# Altium schematic sheet SensorRig.SchDoc
size Letter
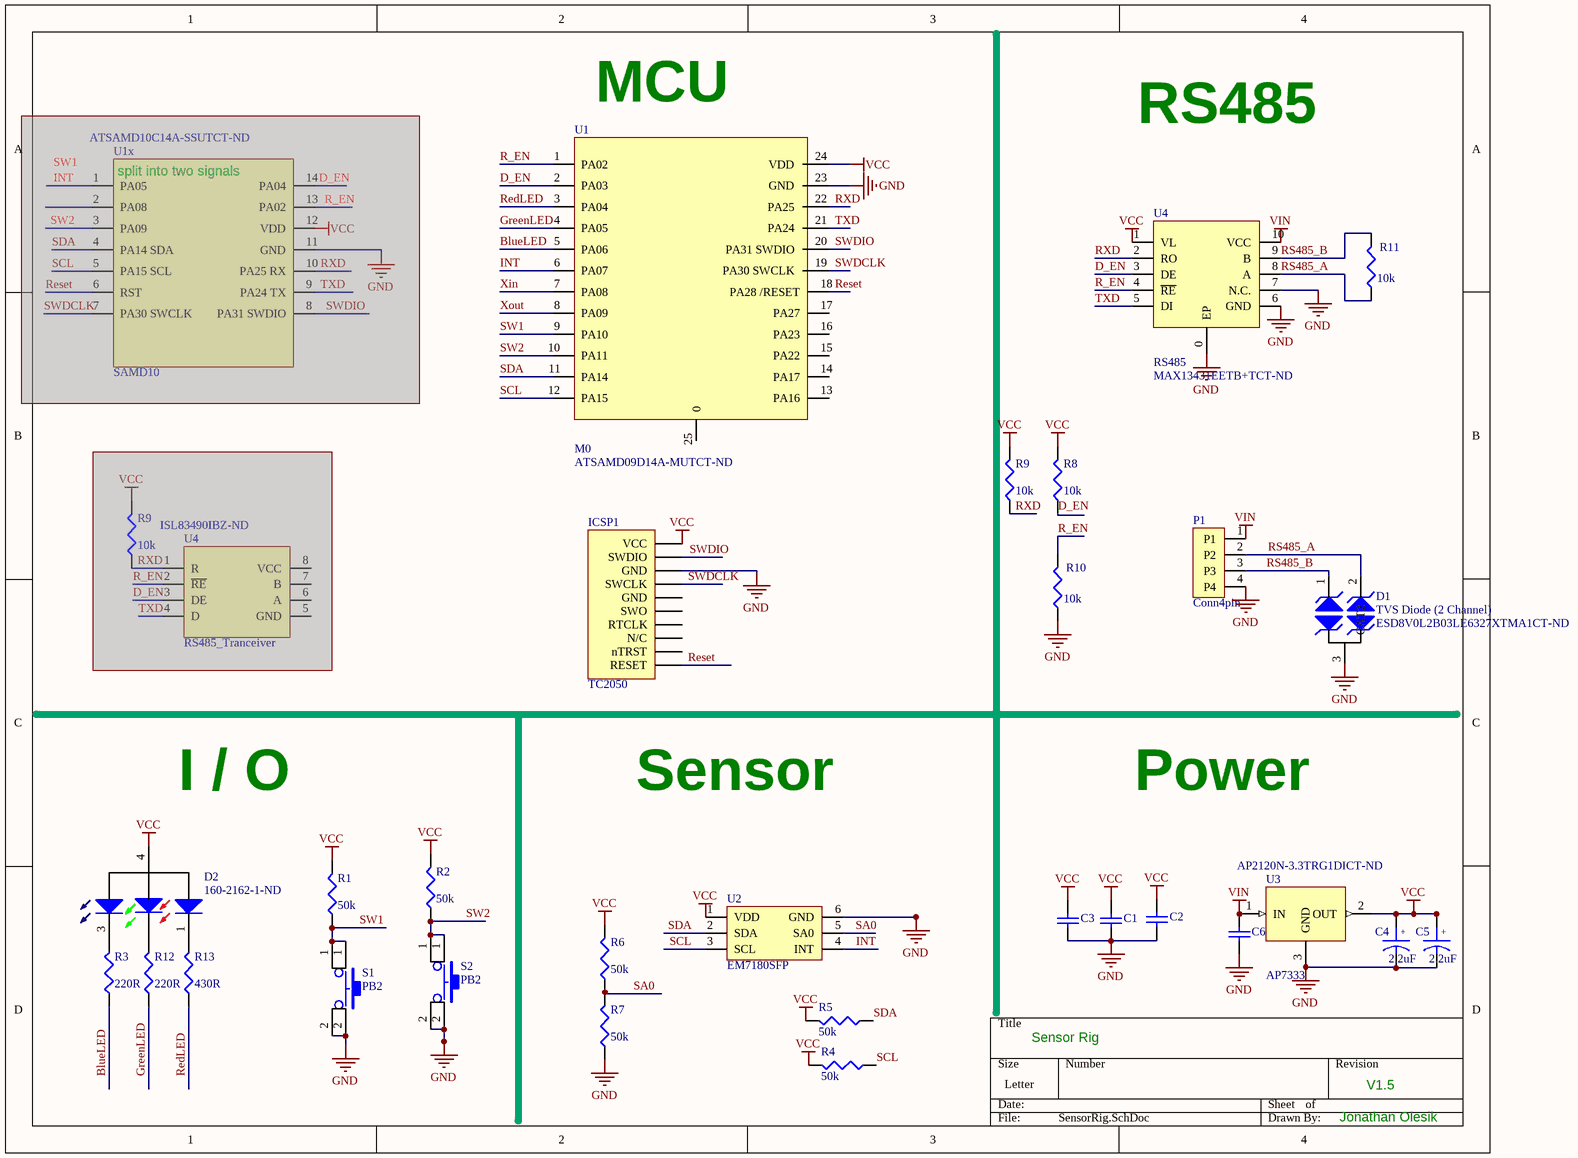
[diagram p0: SensorRig.SchDoc]

## Parts
(Parts that share a designator on the sheet are numbered #1, #2 ... from top to bottom, then left to right.)
C1  100nF  [0603]  (value not drawn)
C2  4.7uF  [0603]  (value not drawn)
C3  Cap  [0603]  (value not drawn)
C4  value 2.2uF  [SMD0805]
C5  value 2.2uF  [SMD0805]
C6  10uF  [0603]  (value not drawn)
D1  TVS Diode (2 Channel)  Supplier Part Number: ESD8V0L2B03LE6327XTMA1CT-ND  [SON35P100X50-3N]
D2  Supplier Part Number: 160-2162-1-ND  [LED RGB]  (hidden comment: LED2_RGB)
ICSP1  TC2050  [TagConnect]
P1  Conn4pin  [Bourns 70AB/Male (4 conn)]
R1  value 50k  [0603]
R2  value 50k  [0603]
R3  value 220R  [0603]
R4  value 50k  [0603]
R5  value 50k  [0603]
R6  value 50k  [0603]
R7  value 50k  [0603]
R8  value 10k  [0603]
R9#1  value 10k  [0603]
R9#2  value 10k  [0603]  (masked out: inside a compile mask, not in the netlist)
R10  value 10k  [0603]
R11  value 10k  [0603]
R12  value 220R  [0603]
R13  value 430R  [0603]
S1  PB2  [PTS840]
S2  PB2  [PTS840]
U1  M0  Supplier Part Number: ATSAMD09D14A-MUTCT-ND  [QFN50P400X400X80_HS-25N]
U1x  SAMD10  Supplier Part Number: ATSAMD10C14A-SSUTCT-ND  [SOIC14]  (masked out: inside a compile mask, not in the netlist)
U2  EM7180SFP  [EM7180SFP]
U3  AP7333  Supplier Part Number: AP2120N-3.3TRG1DICT-ND  [SOT23-3]
U4#1  RS485  Supplier Part Number: MAX13431EETB+TCT-ND  [DFN10_3X3MM]
U4#2  RS485_Tranceiver  Supplier Part Number: ISL83490IBZ-ND  [SOIC8]  (masked out: inside a compile mask, not in the netlist)

## Nets
GND: C1.1 C2.1 C3.1 C4.2 C5.2 C6.1 D1.3(Double_Cat) ICSP1.3(GND) P1.4(P4) R7.1 R10.1 S1.2 S2.2 U1.23(GND) U2.6(GND) U3.3(GND) U4#1.0(EP) U4#1.6(GND) U4#1.7(N.C.)
VCC: C1.2 C2.2 C3.2 C4.1 C5.1 D2.4 ICSP1.1(VCC) R1.2 R2.2 R4.2 R5.2 R6.2 R8.2 R9#1.2 U1.24(VDD) U2.1(VDD) U3.2(OUT) U4#1.1(VL)
VIN: C6.2 P1.1(P1) U3.1(IN) U4#1.10(VCC)
BlueLED: R3.1 U1.5(PA06)
D_EN: R8.1 U1.2(PA03) U4#1.3(DE)
GreenLED: R12.1 U1.4(PA05)
INT: U1.6(PA07) U2.4(INT)
R_EN: R10.2 U1.1(PA02) U4#1.4(~{RE})
RedLED: R13.1 U1.3(PA04)
Reset: ICSP1.10(RESET) U1.18(PA28_/RESET)
RS485_A: D1.2(CAT2) P1.2(P2) R11.1 U4#1.8(A)
RS485_B: D1.1(CAT1) P1.3(P3) R11.2 U4#1.9(B)
RXD: R9#1.1 U1.22(PA25) U4#1.2(RO)
SA0: R6.1 R7.2 U2.5(SA0)
SCL: R4.1 U1.12(PA15) U2.3(SCL)
SDA: R5.1 U1.11(PA14) U2.2(SDA)
SW1: R1.1 S1.1 U1.9(PA10)
SW2: R2.1 S2.1 U1.10(PA11)
SWDCLK: ICSP1.4(SWCLK) U1.19(PA30_SWCLK)
SWDIO: ICSP1.2(SWDIO) U1.20(PA31_SWDIO)
TXD: U1.21(PA24) U4#1.5(DI)
Xin: U1.7(PA08)
Xout: U1.8(PA09)
NetD2_1: D2.1 R13.2
NetD2_2: D2.2 R12.2
NetD2_3: D2.3 R3.2

Not connected (* = marked no-connect by the designer): ICSP1 5(GND) 6(SWO) 7(RTCLK) 8(N/C) 9(nTRST); U1 13(PA16) 14(PA17) 15(PA22) 16(PA23) 17(PA27) 25(0)

## Notes on the sheet
- (near U1) MCU
- RS485
- (near U1x) split into two signals
- I / O
- Sensor
- Power
- Sensor Rig
- V1.5
- Jonathan Olesik
- (in symbol A01-0492) +

## Library data of the parts
C1-C3 C6 = Cap: Capacitor; Published: 8-Jun-2000; LatestRevisionDate: 17-Jul-2002; LatestRevisionNote: Re-released for DXP Platform.; PackageReference: RAD-0.3; Publisher: Altium Limited
C4 C5 = A01-0492: Manufacturer Size Code: P; Manufacturer: AVX Corporation; Manufacturer Part Number: F921A225MPA; Tolerance: ±20%; Type: Molded; ESR (Equivalent Series Resistance): 12 Ohm; Capacitance: 2.2µF; Voltage - Rated: 10V; Category: Capacitors; Size / Dimension: 0.079" L x 0.049" W (2.00mm x 1.25mm); RoHS: RoHS Compliant; Operating Temperature: -55°C ~ 125°C; Mounting Type: Surface Mount; Package / Case: 0805 (2012 Metric); Height - Seated (Max): 0.039" (1.00mm); Lifetime @ Temp.: -; Supplier: Digi-Key; Packaging: Cut Tape (CT); Features: General Purpose; Lead Spacing: -; Supplier Part Number: 478-8123-1-ND; ComponentLink1URL: http://www.avx.com/docs/Catalogs/f92.pdf; ComponentLink1Description: http://www.avx.com/docs/Catalogs/f92.pdf; Pricing: 1=0.45, 10=0.397, 100=0.1983, 250=0.15856, 500=0.14442, 1000=0.13025 (CAD)
D1 = TVS Diode (2 Channel): Manufacturer Part Number: ESD8V0L2B-03L E6327; Manufacturer: Infineon Technologies; Type: Zener; Bidirectional Channels: 2; Description: TVS DIODE 22VWM 26VC TSLP2; Voltage - Reverse Standoff (Typ): 22V (Max); Voltage - Breakdown (Min): 23V (Typ); Capacitance @ Frequency: 4pF @ 1MHz; Current - Peak Pulse (10/1000µs): 1A (8/20µs); Voltage - Clamping (Max) @ Ipp: 26V (Typ); Power Line Protection: No; Supplier: Digi-Key; Category: Circuit Protection; Unidirectional Channels: -; RoHS: RoHS Compliant; Applications: General Purpose; Package / Case: SC-101, SOT-883; Power - Peak Pulse: -; Operating Temperature: -55°C ~ 125°C (TJ); Supplier Device Package: PG-TSLP-3; Packaging: Cut Tape (CT); Mounting Type: Surface Mount; ComponentLink1URL: http://www.infineon.com/dgdl/esd8v0lseries.pdf?folderId=db3a30431441fb5d011488a9e66f0ded&fileId=db3a30431441fb5d011488ab01860dee; ComponentLink1Description: http://www.infineon.com/dgdl/esd8v0lseries.pdf?folderId=db3a30431441fb5d011488a9e66f0ded&fileId=db3a30431441fb5d011488ab01860dee; Pricing: 1=0.59, 10=0.438, 100=0.2481, 500=0.16456, 1000=0.1262 (CAD)
D2 = LED2_RGB: RGB Led; Manufacturer Part Number: LTST-C19HE1WT; Manufacturer: Lite-On Inc; Lens Transparency: Diffused; Millicandela Rating: 112.5mcd Red, 281mcd Green, 104mcd Blue; Wavelength - Dominant: 624nm Red, 525nm Green, 470nm Blue; Wavelength - Peak: 632nm Red, 520nm Green, 468nm Blue; Lens Color: White; Current - Test: 20mA Red, 20mA Green, 20mA Blue; Voltage - Forward (Vf) (Typ): 2.1V Red, 3.35V Green, 3.35V Blue; Color: Red, Green, Blue (RGB); Lens Style/Size: Rectangle with Flat Top, 1.15mm x 1.60mm; Viewing Angle: 130°; Package / Case: 0606 (1616 Metric); Supplier: Digi-Key; Height (Max): 0.35mm; Size / Dimension: 1.60mm L x 1.60mm W; RoHS: RoHS Compliant; Mounting Type: Surface Mount; Category: Optoelectronics; Packaging: Cut Tape (CT); Supplier Device Package: *; Pricing: 1=0.82, 10=0.632, 100=0.4097, 250=0.35112, 500=0.3043, 1000=0.23407 (CAD); ComponentLink1URL: http://optoelectronics.liteon.com/upload/download/DS22-2008-0044/S_110_LTST-C19HE1WT.pdf; ComponentLink1Description: http://optoelectronics.liteon.com/upload/download/DS22-2008-0044/S_110_LTST-C19HE1WT.pdf
ICSP1 = TC2050: ICSP Header
R1 R2 R4-R8 R9#1 R9#2 R10 R11 = Res3: Resistor; Published: 8-Jun-2000; LatestRevisionDate: 04-Mar-2005; LatestRevisionNote: PCB Footprint replaced.; PackageReference: J1-0603; Publisher: Altium Limited
R3 R12 = Res3: Resistor; Manufacturer Part Number: ESR03EZPJ221; Manufacturer: Rohm Semiconductor; Power (Watts): 0.25W, 1/4W; Resistance (Ohms): 220; Temperature Coefficient: ±200ppm/°C; Tolerance: ±5%; Package / Case: 0603 (1608 Metric); Number of Terminations: 2; Features: Automotive AEC-Q200, Pulse Withstanding; Packaging: Cut Tape (CT); Supplier: Digi-Key; Size / Dimension: 0.063" L x 0.031" W (1.60mm x 0.80mm); Supplier Part Number: RHM220DCT-ND; Height: 0.022" (0.55mm); Composition: Thick Film; RoHS: RoHS Compliant; Supplier Device Package: 0603 (1608 Metric); Operating Temperature: -55°C ~ 155°C; Category: Resistors; ComponentLink1URL: http://rohmfs.rohm.com/en/products/databook/datasheet/passive/resistor/chip_resistor/esr.pdf; ComponentLink1Description: http://rohmfs.rohm.com/en/products/databook/datasheet/passive/resistor/chip_resistor/esr.pdf; Pricing: 1=0.15, 10=0.118, 25=0.0812, 100=0.0451, 250=0.03516, 500=0.02794, 1000=0.01982 (CAD)
R13 = Res3: Resistor; Manufacturer Part Number: ESR03EZPJ431; Manufacturer: Rohm Semiconductor; Temperature Coefficient: ±200ppm/°C; Power (Watts): 0.25W, 1/4W; Tolerance: ±5%; Resistance (Ohms): 430; Supplier Part Number: RHM430DCT-ND; Composition: Thick Film; Features: Automotive AEC-Q200, Pulse Withstanding; Supplier Device Package: 0603 (1608 Metric); Number of Terminations: 2; Supplier: Digi-Key; Size / Dimension: 0.063" L x 0.031" W (1.60mm x 0.80mm); Operating Temperature: -55°C ~ 155°C; Height: 0.022" (0.55mm); Packaging: Cut Tape (CT); Package / Case: 0603 (1608 Metric); RoHS: RoHS Compliant; Category: Resistors; ComponentLink1URL: http://rohmfs.rohm.com/en/products/databook/datasheet/passive/resistor/chip_resistor/esr.pdf; ComponentLink1Description: http://rohmfs.rohm.com/en/products/databook/datasheet/passive/resistor/chip_resistor/esr.pdf; Pricing: 1=0.15, 10=0.118, 25=0.0812, 100=0.0451, 250=0.03516, 500=0.02794, 1000=0.01982 (CAD)
S1 S2 = SW PUSHBUTTON: SWITCH TACT 2.36MM SILV J-LEAD; Manufacturer: C&K; MPN: KT11P2JM34LFS; Value: Tact Switch; Populate: Y; DigiKeyPartNumber: KT11P2JM, KT11P2JM34LFS; SMT: Y; PartType: Switch
U1 = SAMD10: Atmel SamD10 or SamD09; Manufacturer Part Number: ATSAMD09D14A-MUT; Program Memory Type: FLASH; RAM Size: 4K x 8; Core Processor: ARM® Cortex®-M0+; Program Memory Size: 16KB (16K x 8); Oscillator Type: Internal; Data Converters: A/D 10x12b; Voltage - Supply (Vcc/Vdd): 1.62 V ~ 3.63 V; Number of I/O: 22; Peripherals: Brown-out Detect/Reset, DMA, POR, WDT; Connectivity: I²C, LIN, SPI, UART/USART; Speed: 48MHz; Core Size: 32-Bit; Manufacturer: Atmel; Package / Case: 24-VFQFN Exposed Pad; Operating Temperature: -40°C ~ 85°C (TA); EEPROM Size: -; Packaging: Cut Tape (CT); RoHS: RoHS Compliant; Supplier: Digi-Key; Category: Integrated Circuits (ICs); Supplier Device Package: 24-QFN (4x4); Pricing: 1=1.67, 10=1.466, 25=1.324, 100=1.1581, 250=1.01568, 500=0.90078, 1000=0.71235 (CAD); ComponentLink1URL: http://www.atmel.com/Images/Atmel-42414-SAM-D09_Datasheet.pdf; ComponentLink1Description: http://www.atmel.com/Images/Atmel-42414-SAM-D09_Datasheet.pdf
U1x = SAMD09: Manufacturer Part Number: ATSAMD10C14A-SSUT; Manufacturer: Atmel; Core Processor: ARM® Cortex®-M0+; Program Memory Type: FLASH; Program Memory Size: 16KB (16K x 8); Number of I/O: 12; Data Converters: A/D 5x12b, D/A 1x10b; Oscillator Type: Internal; Speed: 48MHz; Peripherals: Brown-out Detect/Reset, DMA, POR, WDT; Voltage - Supply (Vcc/Vdd): 1.62 V ~ 3.63 V; Connectivity: I²C, LIN, SPI, UART/USART; RAM Size: 4K x 8; Core Size: 32-Bit; Supplier Device Package: 14-SOIC; Category: Integrated Circuits (ICs); EEPROM Size: -; Operating Temperature: -40°C ~ 85°C (TA); Supplier: Digi-Key; Packaging: Cut Tape (CT); RoHS: RoHS Compliant; Package / Case: 14-SOIC (0.154", 3.90mm Width); ComponentLink1URL: http://www.atmel.com/Images/Atmel-42242-SAM-D10_Summary.pdf; ComponentLink1Description: http://www.atmel.com/Images/Atmel-42242-SAM-D10_Summary.pdf; Pricing: 1=3.02, 10=2.73, 25=2.4452, 100=2.1989, 250=1.95248, 500=1.70606, 1000=1.41224 (CAD)
U3 = AP7333: 3.3 V regulator; Manufacturer: Diodes Incorporated; Manufacturer Part Number: AP2120N-3.3TRG1; Number of Regulators: 1; Voltage - Output: 3.3V; Regulator Topology: Positive Fixed; Current - Output: 150mA; Voltage - Input: Up to 6V; Voltage - Dropout (Typical): 0.3V @ 150mA; Supplier Device Package: SOT-23; Packaging: Cut Tape (CT); Supplier: Digi-Key; Category: Integrated Circuits (ICs); RoHS: RoHS Compliant; Current - Limit (Min): -; Package / Case: TO-236-3, SC-59, SOT-23-3; Operating Temperature: -40°C ~ 85°C; Mounting Type: Surface Mount; ComponentLink1URL: http://www.diodes.com/_files/datasheets/AP2120.pdf; ComponentLink1Description: http://www.diodes.com/_files/datasheets/AP2120.pdf; Pricing: 1=0.54, 10=0.399, 100=0.2252, 500=0.1494, 1000=0.11459 (CAD)
U4#1 = RS485_Tranceiver_10pin: RS-485 Transceivers with Low-Voltage Logic Interface; Manufacturer Part Number: MAX13431EETB+T; Manufacturer: Maxim Integrated; Receiver Hysteresis: 15mV; Voltage - Supply: 3 V ~ 5.5 V; Data Rate: 16Mbps; Duplex: Half; Protocol: RS422, RS485; Number of Drivers/Receivers: 1/1; Description: IC TXRX RS422/485 16MBPS 10TDFN; Category: Integrated Circuits (ICs); Mounting Type: Surface Mount; Type: Transceiver; Operating Temperature: -40°C ~ 85°C; Supplier Device Package: 10-TDFN-EP (3x3); Supplier: Digi-Key; Package / Case: 10-WFDFN Exposed Pad; Packaging: Cut Tape (CT); RoHS: RoHS Compliant; ComponentLink1URL: http://datasheets.maximintegrated.com/en/ds/MAX13430E-MAX13433E.pdf; ComponentLink1Description: http://datasheets.maximintegrated.com/en/ds/MAX13430E-MAX13433E.pdf; Pricing: 1=7.02, 10=6.615, 25=5.292, 50=5.0276, 100=4.6306, 250=4.39248, 500=4.23372 (CAD)
U4#2 = RS485_Tranceiver: Manufacturer Part Number: ISL83490IBZ; Manufacturer: Intersil; Number of Drivers/Receivers: 1/1; Voltage - Supply: 3 V ~ 3.6 V; Duplex: Full; Data Rate: 10Mbps; Protocol: RS422, RS485; Receiver Hysteresis: 50mV; Supplier: Digi-Key; Operating Temperature: -40°C ~ 85°C; Category: Integrated Circuits (ICs); Mounting Type: Surface Mount; Type: Transceiver; RoHS: RoHS Compliant; Package / Case: 8-SOIC (0.154", 3.90mm Width); Packaging: Tube; Supplier Device Package: 8-SOIC; Pricing: 1=1.97, 10=1.767, 100=1.3774, 500=1.13784, 1000=0.8983 (CAD); ComponentLink1URL: http://www.intersil.com/content/dam/Intersil/documents/isl8/isl83483-85-88-90-91.pdf; ComponentLink1Description: http://www.intersil.com/content/dam/Intersil/documents/isl8/isl83483-85-88-90-91.pdf